# Altium schematic sheet BuckBoost5V.SchDoc: BuckBoost
size Letter; ApprovedBy: Kevin; Author: Jessica; Organization: Cegep Limoilou; Address1: 1300, 8e Avenue; Address2: Québec, QC; Address3: Canada; Address4: G1J 5L5; Revision: A; SheetNumber: 2; SheetTotal: 4
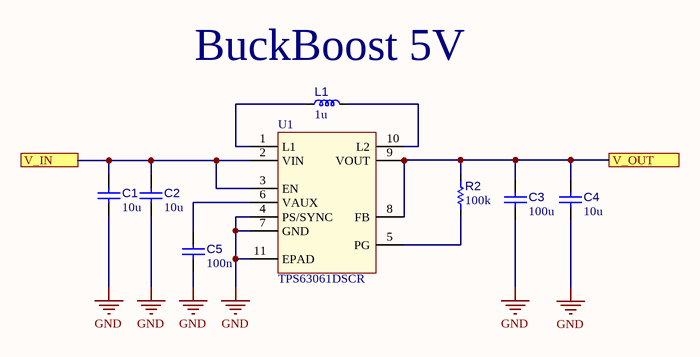
[diagram p0: BuckBoost5V.SchDoc]

## Parts
C1  value 10u  [C_2012[0805]]  (hidden comment: CAP CER 10uF 10V X7R 0805)
C2  value 10u  [C_2012[0805]]  (hidden comment: CAP CER 10uF 10V X7R 0805)
C3  value 100u  [C_3216[1206]]  (hidden comment: CAP CER 100uF 10V 1206)
C4  value 10u  [C_2012[0805]]  (hidden comment: CAP CER 10uF 10V X7R 0805)
C5  value 100n  [C_1005[0402]]  (hidden comment: CAP CER 100nF 50V 0402)
L1  value 1u  [L_4040[1515]]  (hidden comment: Inductor 1UH 3.2A 32mΩ SMD)
R2  value 100k  [R_1608[0603]]  (hidden comment: Res 100k 1% 0603)
U1  TPS63061DSCR  [U_WSON50P300X300X80-10N]

## Ports
V_IN, V_OUT

## Nets
GND: C1.1 C2.1 C3.1 C4.1 C5.1 U1.4(PS/SYNC) U1.7(GND) U1.11(EPAD)
V_IN: C1.2 C2.2 U1.2(VIN) U1.3(EN) ; port V_IN
V_OUT: C3.2 C4.2 R2.2 U1.8(FB) U1.9(VOUT) ; port V_OUT
NetC5_2: C5.2 U1.6(VAUX)
NetL1_1: L1.1 U1.1(L1)
NetL1_2: L1.2 U1.10(L2)
NetR2_1: R2.1 U1.5(PG)

## Notes on the sheet
- (near L1) BuckBoost 5V
- Titre :
- Conception :
- Date :
- Approbation :
- Heure :
- Révision :
- Feuille
- de
- Fichier :

## Library data of the parts
C1 C2 C4 = CAP004: Capacitor type 1; Manufacturer 1: muRata; Manufacturer Part Number 1: GRM21BR71A106KE51L; LibRef: CAP004; Code CEGEP: KCOND03SM; Tolerance: 10%; Rated Voltage: 10V; Dielectric: X7R; Mounting Technology: SMT; Supplier 1: LCSC; Supplier Part Number 1: C86038
C3 = CAP005: Capacitor type 1; Manufacturer 1: Murata; Manufacturer Part Number 1: GRM31CR61A107MEA8L; LibRef: CAP005; Code CEGEP: KCOND04SM; Tolerance: 20%; Dielectric: X5R; Rated Voltage: 10V; Mounting Technology: SMT; Supplier 1: LCSC; Supplier Part Number 1: C883598
C5 = CAP001: Capacitor type 1; Manufacturer 1: Yageo; Manufacturer Part Number 1: CC0402KRX7R9BB104; LibRef: CAP001; Code CEGEP: KCOND01SM; Tolerance: 10%; Dielectric: X7R; Rated Voltage: 50V; Mounting Technology: SMT; Supplier 1: LCSC; Supplier Part Number 1: C131394
L1 = IND006: Inductor type 1; Manufacturer 1: Taiyo Yuden; Manufacturer Part Number 1: LSXND4040TKL1R0NDG; LibRef: IND006; Tolerance: 30%; Saturation Current: 4A; DCR: 0R032; Mounting Technology: SMT; Supplier 1: LCSC; Supplier Part Number 1: C6891223
R2 = RES002: Resistor type 1; Manufacturer 1: Yageo; Manufacturer Part Number 1: RC0603FR-07100KL; LibRef: RES002; Puissance: 1/10W; Max Working Voltage: 75V; Tolerance: 1%; Mounting Technology: SMT; Supplier 1: LCSC; Supplier Part Number 1: C14675
U1 = U_TPS63061DSC: IC REG BUCK BOOST 5V 2A 10WSON; Manufacturer 1: TI; Manufacturer Part Number 1: TPS63061DSCR; Mounting Technology: SMT; Supplier 1: LCSC; Supplier 2: Digikey; Supplier Part Number 1: C2876326; Supplier Part Number 2: 296-30205-1-ND